# EAGLE design USB_Power_Adapter (EAGLE 6.5.0)
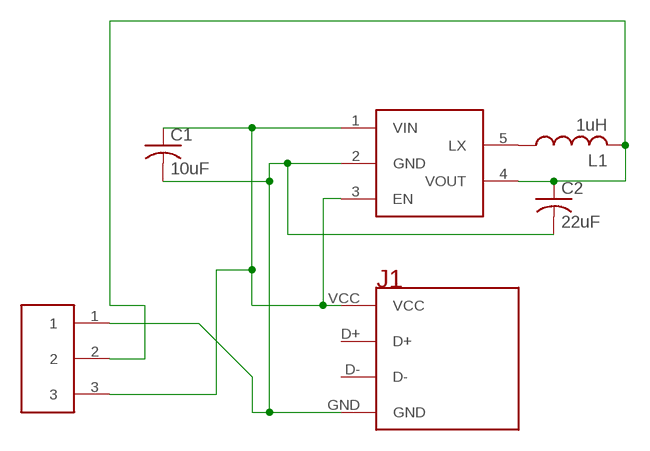
[diagram p0: schematic, sheet 1]

## Parts
C1  10uF  C-USC0805K  [C0805K]
C2  22uF  C-USC0805K  [C0805K]
J1  MICROUSBMICROUSB_THRU  [MICROUSB_THRU]
L1  1uH  L-USL3225M  [L3225M]
U1  SC189  [SC189]
U$2  DF3_1X3  [DF3_1X3]

## Nets
GND: C1.2 C2.2 J1.GND U1.2(GND) U$2.1
LX: L1.1 U1.5(LX)
N$1: C1.1 J1.VCC U1.1(VIN) U1.3(EN) U$2.3
N$3: C2.1 L1.2 U1.4(VOUT) U$2.2
Unconnected: J1.D+ J1.D-

## Library data of the parts
C1 C2 = resistor:C-US: CAPACITOR, American symbol
J1 = ScottSilver:MICROUSB
L1 = resistor:L-US: INDUCTOR, American symbol
U1 = ScottSilver:SC189
U$2 = ScottSilver:DF3_1X3

## Board
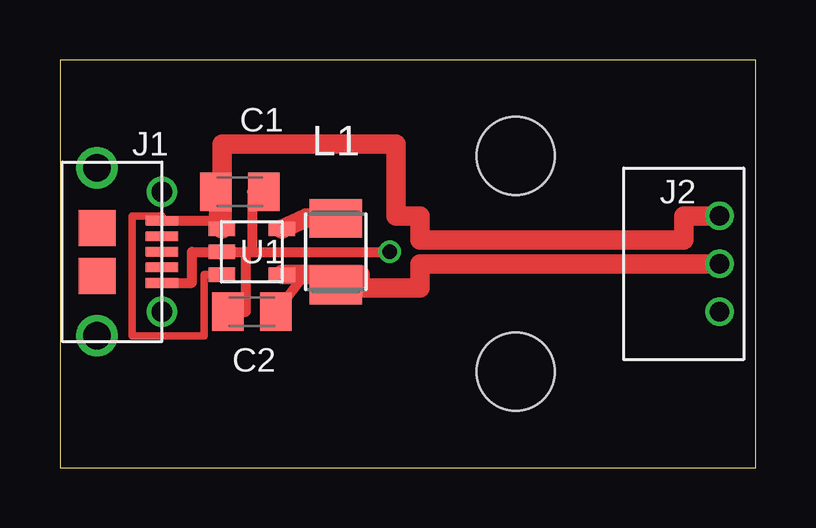
[diagram p1: board, top side]
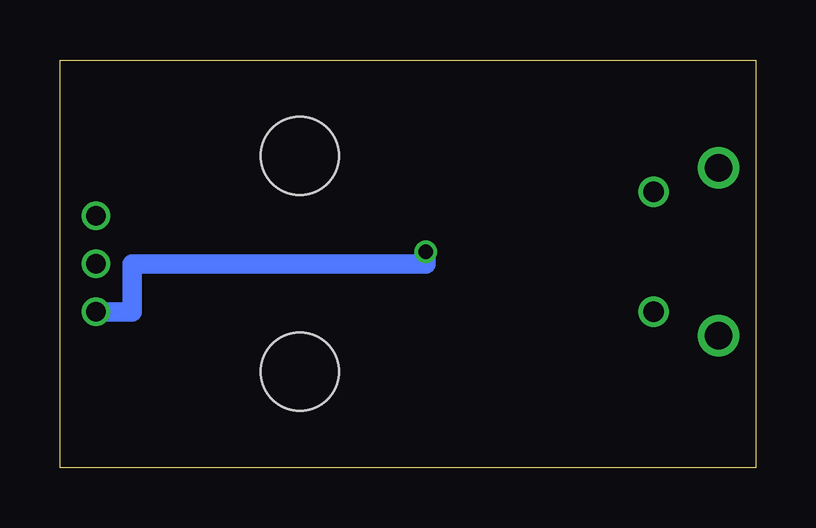
[diagram p2: board, bottom side, seen from below]

Size 29 x 17 mm. Coordinates in mm from the lower left corner, seen from the top.
Outline: 0,0 29,0 29,17 0,17 0,0
Copper layers (1*16): Top 0.0356mm / dielectric 1.5011mm / Bottom 0.0356mm
Design rules "LaenPCBOrder": minimum track width 6mil, minimum drill 13mil, track to track 6mil, track to pad 6mil, pad to pad 6mil, via to via 6mil, smd to smd 6mil, copper to edge 15mil, drill to drill 6mil, minimum pad ring 7mil, minimum via ring 7mil, stop-mask expansion 3mil, vias tented up to drill 0mil, thermal gap 10mil
Holes 3.26 mm at 19,13 19,4

### Footprints (pad centres in the part's own frame; a part is rotated, then mirrored left to right if it is on the bottom)
C0805K = smd 1.3 x 1.6: 1 -1,0; 2 1,0
MICROUSB_THRU = smd 1.35 x 0.4: D+ 0,0; D- 0,0.65; GND 0,-1.3; ID 0,-0.65; VCC 0,1.3 | drill 1.15: P$1 -2.7,3.5; P$2 -2.7,-3.5 | drill 0.85: P$3 0,2.5; P$4 0,-2.5 | smd 1.55 x 1.5: P$6 -2.7,1; P$7 -2.7,-1
L3225M = smd 1.6 x 2.2: 1 -1.4,0; 2 1.4,0
SC189 = smd 0.6 x 1.1: 1 -0.95,-1.25; 2 0,-1.25; 3 0.95,-1.25; 4 0.95,1.25; 5 -0.95,1.25
DF3_1X3 = drill 0.8: 1 -2,-1.5; 2 0,-1.5; 3 2,-1.5

### Placement (x,y rotation side)
C1  7.5,11.5 0 top
C2  8,6.5 180 top
J1  4.25,9 0 top
L1  11.5,9 270 top
U1  8,9 270 top
U$2  26,8.5 90 top

### Tracks (layer width: path | path; a pad name or v marks a point on that pad's centre or on a via)
GND  (via drill 0.6)
  Top 0.406: J1.GND 5.5,7.7 5.5,9 U1.2 7.75,9 | 7.75,9 8,9 | 8,9 v13.75,9 | C2.2 7.75,6.5 7.75,9 | C1.2 8,11.5 8,9
  Bottom 0.813: v13.75,9 13.75,8.5 26,8.5 26,6.5 U$2.1
LX
  Top 0.813: U1.5 10.25,10.4 L1.1
N$1
  Top 0.305: U1.3 6,8.05 6,5.5 3,5.5 3,10.5 4.25,10.5 J1.VCC
  Top 0.406: J1.VCC 6.5,10.3 C1.1
  Top 0.61: U1.1 6.5,9.95 C1.1
  Top 0.813: U1.1 6.75,13.5 14,13.5 14,10.5 15,10.5 15,9.5 26,9.5 26,10.5 U$2.3
N$3
  Top 0.406: U1.4 10,7.8 C2.1
  Top 0.813: L1.2 12.5,8.05 | 12.5,8.05 U1.4 | 12.5,8.05 12.5,7.5 15,7.5 15,8.5 U$2.2

### Text on the board
tPlace: J1 | J2 | U1